# EAGLE design Ei (EAGLE 5.10)
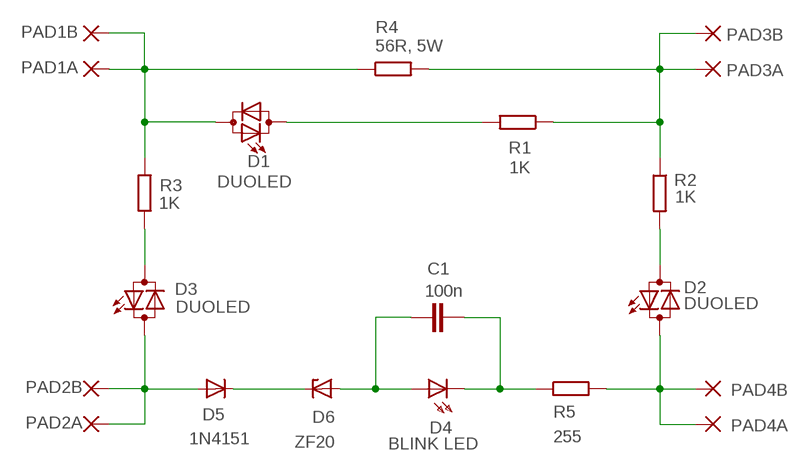
[diagram p0: schematic, sheet 1]

## Parts
C1  100n  C-EU025-025X050  [C025-025X050]
D1  DUOLED  LEDDUO  [LED5MM]
D2  DUOLED  LEDDUO  [LED5MM]
D3  DUOLED  LEDDUO  [LED5MM]
D4  BLINK LED  LED5MM  [LED5MM]
D5  1N4151  1N4004  [DO41-10]
D6  ZF20  ZPY  [DO41Z10]
PAD1A  2,54/1,0  [2,54/1,0]
PAD1B  2,54/1,0  [2,54/1,0]
PAD2A  2,54/1,0  [2,54/1,0]
PAD2B  2,54/1,0  [2,54/1,0]
PAD3A  2,54/1,0  [2,54/1,0]
PAD3B  2,54/1,0  [2,54/1,0]
PAD4A  2,54/1,0  [2,54/1,0]
PAD4B  2,54/1,0  [2,54/1,0]
R1  1K  R-EU_0207/10  [0207/10]
R2  1K  R-EU_0207/10  [0207/10]
R3  1K  R-EU_0207/10  [0207/10]
R4  56R, 5W  R-EU_0617/22  [0617/22]
R5  255  R-EU_0207/10  [0207/10]

## Nets
D6: D5.C D6.C
N$1: D1.A PAD1A.1(P) PAD1B.1(P) R3.2 R4.1
N$2: D3.A R3.1
N$3: D3.K(C) D5.A PAD2A.1(P) PAD2B.1(P)
N$5: D1.K(C) R1.2
N$7: C1.1 D4.A D6.A
N$8: C1.2 D4.K(C) R5.1
N$9: D2.K(C) PAD4A.1(P) PAD4B.1(P) R5.2
N$10: PAD3A.1(P) PAD3B.1(P) R1.1 R2.1 R4.2
N$11: D2.A R2.2

## Library data of the parts
C1 = rcl:C-EU: CAPACITOR, European symbol
D1-D3 = LEDDUO:LEDDUO
D4 = led:LED: LED
D5 = diode:1N4004: DIODE general purpose rectifier, 1 A
D6 = diode:ZPY: Z DIODE 1 W
PAD1A PAD1B PAD2A PAD2B PAD3A PAD3B PAD4A PAD4B = wirepad:2,54/1,0: THROUGH-HOLE PAD
R1-R5 = rcl:R-EU_: RESISTOR, European symbol

## Board
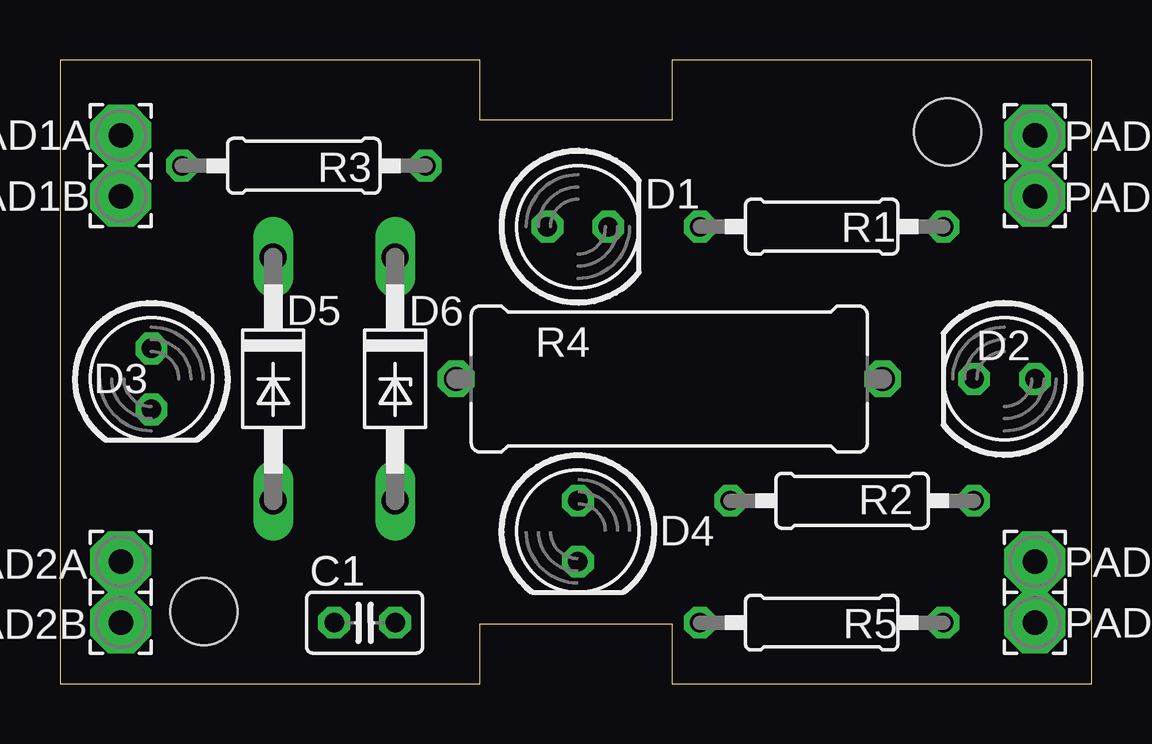
[diagram p1: board, top side]
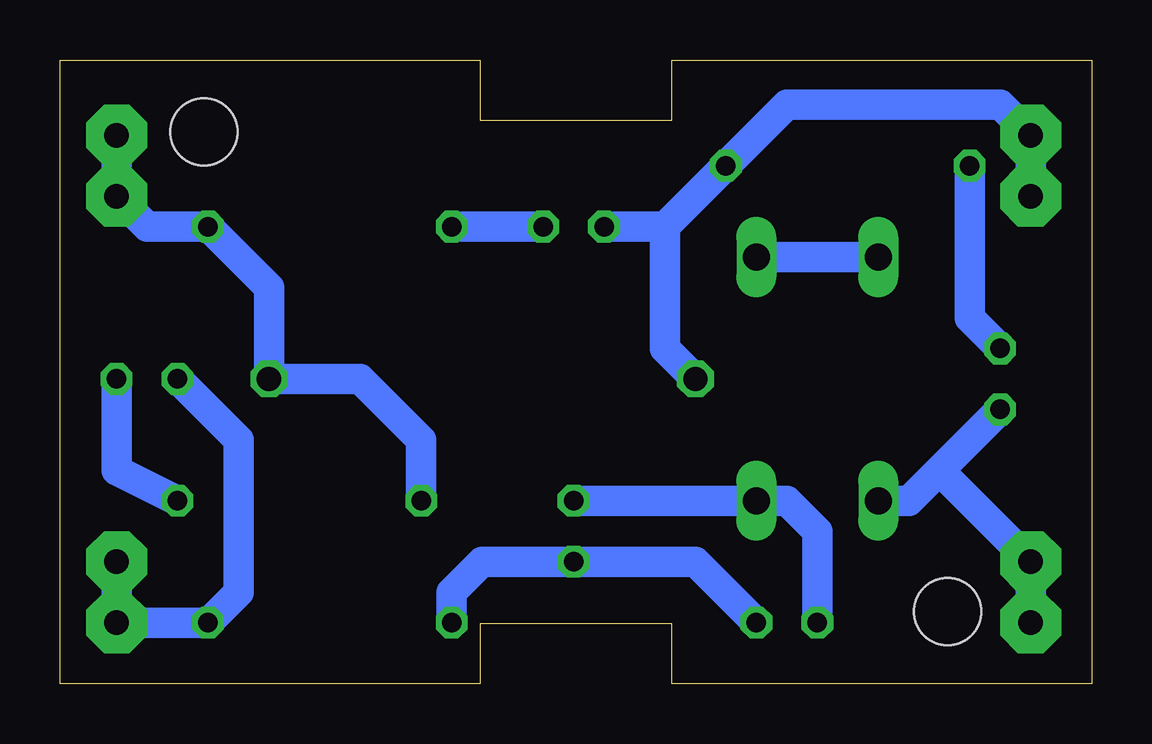
[diagram p2: board, bottom side, seen from below]

Size 43 x 26 mm. Coordinates in mm from the lower left corner, seen from the top.
Outline: 0,0 17.5,0 17.5,2.5 25.5,2.5 25.5,0 43,0 43,26 25.5,26 25.5,23.5 17.5,23.5 17.5,26 0,26 0,0
Copper layers (1*16): Top 0.035mm / dielectric 1.5mm / Bottom 0.035mm
Design rules "default": minimum track width 10mil, minimum drill 24mil, track to track 8mil, track to pad 8mil, pad to pad 8mil, via to via 8mil, smd to smd 8mil, copper to edge 40mil, drill to drill 8mil, minimum pad ring 10mil, minimum via ring 8mil, stop-mask expansion 4mil, vias tented up to drill 0mil, thermal gap 10mil
Holes 2.8 mm at 6,3 37,23
bKeepout: area 4,1 to 8,5; area 35,21 to 39,25

### Footprints (pad centres in the part's own frame; a part is rotated, then mirrored left to right if it is on the bottom)
C025-025X050 = drill 0.813 octagon: 1 -1.27,0; 2 1.27,0
LED5MM = drill 0.813 octagon: A -1.27,0; K 1.27,0
DO41-10 = drill 1.118 long: A 5.08,0; C -5.08,0
DO41Z10 = drill 1.118 long: A 5.08,0; C -5.08,0
2,54/1,0 = drill 1.016 pad 2.54 octagon: 1 0,0
0207/10 = drill 0.813 octagon: 1 -5.08,0; 2 5.08,0
0617/17 = drill 1.016 octagon: 1 -8.89,0; 2 8.89,0

### Placement (x,y rotation side)
C1  12.7,2.54 0 top
D1  21.59,19.05 0 top
D2  39.37,12.7 180 top
D3  3.81,12.7 270 top
D4  21.59,6.35 270 top
D5  8.89,12.7 270 top
D6  13.97,12.7 270 top
PAD1A  2.54,22.86 0 top
PAD1B  2.54,20.32 0 top
PAD2A  2.54,5.08 0 top
PAD2B  2.54,2.54 0 top
PAD3A  40.64,22.86 0 top
PAD3B  40.64,20.32 0 top
PAD4A  40.64,5.08 0 top
PAD4B  40.64,2.54 0 top
R1  31.75,19.05 180 top
R2  33.02,7.62 0 top
R3  10.16,21.59 0 top
R4  56R, 5W  [0617/17]  25.4,12.7 0 top
R5  31.75,2.54 0 top

### Tracks (layer width: path | path; a pad name or v marks a point on that pad's centre or on a via)
D6
  Bottom 1.27: D5.C D6.C
N$1
  Bottom 1.27: 17.78,19.05 R3.2 12.7,24.13 3.81,24.13 PAD1A.1 PAD1B.1 | 17.78,19.05 D1.A | R4.1 17.78,13.97 17.78,19.05
N$2
  Bottom 1.27: D3.A 5.08,15.24 R3.1
N$3
  Bottom 1.27: 6.35,8.89 D3.K | 6.35,8.89 7.62,7.62 D5.A | PAD2B.1 PAD2A.1 6.35,8.89
N$5
  Bottom 1.27: D1.K R1.2
N$7
  Bottom 1.27: D4.A D6.A 12.7,7.62 11.43,6.35 C1.1
N$8
  Bottom 1.27: C1.2 16.51,5.08 D4.K 25.4,5.08 26.67,3.81 R5.1
N$9
  Bottom 1.27: D2.K 35.56,10.16 35.56,3.81 R5.2 PAD4B.1 PAD4A.1
N$10
  Bottom 1.27: PAD3A.1 PAD3B.1 39.37,19.05 R1.1 34.29,16.51 R4.2 30.48,12.7 27.94,10.16 R2.1
N$11
  Bottom 1.27: R2.2 40.64,8.89 D2.A